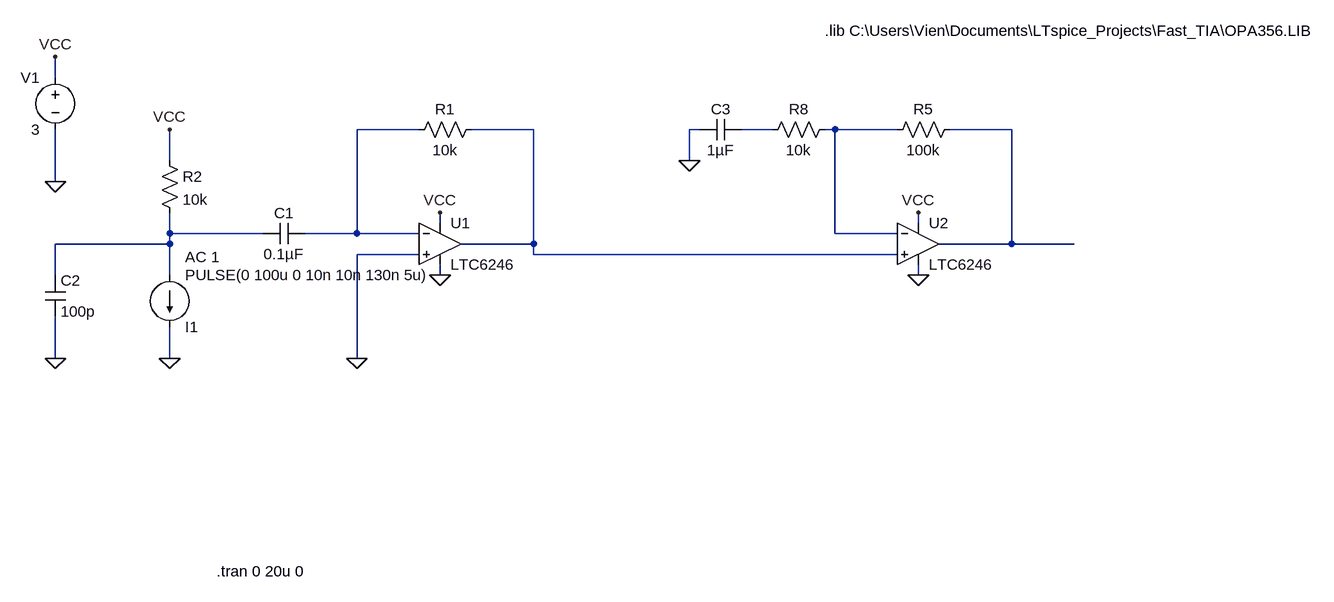
[diagram p0: schematic TIA.asc]
TIA.asc, the LTspice schematic file:
Version 4
SHEET 1 1508 688
WIRE -512 -96 -512 -128
WIRE 48 -16 -48 -16
WIRE 224 -16 128 -16
WIRE 480 -16 464 -16
WIRE 592 -16 544 -16
WIRE 688 -16 672 -16
WIRE 784 -16 688 -16
WIRE 960 -16 864 -16
WIRE -336 32 -336 -16
WIRE 464 32 464 -16
WIRE -512 64 -512 -16
WIRE 80 128 80 112
WIRE 816 128 816 112
WIRE -336 144 -336 112
WIRE -192 144 -336 144
WIRE -48 144 -48 -16
WIRE -48 144 -128 144
WIRE 48 144 -48 144
WIRE 688 144 688 -16
WIRE 784 144 688 144
WIRE -336 160 -336 144
WIRE -336 160 -512 160
WIRE 224 160 224 -16
WIRE 224 160 112 160
WIRE 960 160 960 -16
WIRE 960 160 848 160
WIRE 1056 160 960 160
WIRE 48 176 -48 176
WIRE 224 176 224 160
WIRE 784 176 224 176
WIRE -512 208 -512 160
WIRE -336 208 -336 160
WIRE 80 208 80 192
WIRE 816 208 816 192
WIRE -512 336 -512 272
WIRE -336 336 -336 288
WIRE -48 336 -48 176
FLAG 80 208 0
FLAG 80 112 VCC
FLAG -336 336 0
FLAG -512 336 0
FLAG -336 -16 VCC
FLAG -512 -128 VCC
FLAG -512 64 0
FLAG 816 208 0
FLAG 816 112 VCC
FLAG -48 336 0
FLAG 464 32 0
SYMBOL cap -128 128 R90
WINDOW 0 0 32 VBottom 2
WINDOW 3 32 32 VTop 2
SYMATTR InstName C1
SYMATTR Value 0.1µF
SYMBOL current -336 208 R0
WINDOW 0 24 80 Left 2
WINDOW 3 24 0 Left 2
WINDOW 123 24 -28 Left 2
WINDOW 39 0 0 Left 0
SYMATTR InstName I1
SYMATTR Value PULSE(0 100u 0 10n 10n 130n 5u)
SYMATTR Value2 AC 1
SYMBOL res -352 16 R0
SYMATTR InstName R2
SYMATTR Value 10k
SYMBOL cap -528 208 R0
SYMATTR InstName C2
SYMATTR Value 100p
SYMBOL voltage -512 -112 M0
WINDOW 123 0 0 Left 0
WINDOW 39 0 0 Left 0
SYMATTR InstName V1
SYMATTR Value 3
SYMBOL res 880 -32 R90
WINDOW 0 0 56 VBottom 2
WINDOW 3 32 56 VTop 2
SYMATTR InstName R5
SYMATTR Value 100k
SYMBOL res 688 -32 R90
WINDOW 0 0 56 VBottom 2
WINDOW 3 32 56 VTop 2
SYMATTR InstName R8
SYMATTR Value 10k
SYMBOL cap 544 -32 R90
WINDOW 0 0 32 VBottom 2
WINDOW 3 32 32 VTop 2
SYMATTR InstName C3
SYMATTR Value 1µF
SYMBOL res 144 -32 R90
WINDOW 0 0 56 VBottom 2
WINDOW 3 32 56 VTop 2
SYMATTR InstName R1
SYMATTR Value 10k
SYMBOL Opamps\\LTC6246 816 160 R0
SYMATTR InstName U2
SYMBOL Opamps\\LTC6246 80 160 R0
SYMATTR InstName U1
TEXT -264 664 Left 2 !.tran 0 20u 0
TEXT 672 -168 Left 2 !.lib C:\\Users\\Vien\\Documents\\LTspice_Projects\\Fast_TIA\\OPA356.LIB

The netlist it stands for:
* TIA.asc
C1 N001 N006 0.1µF
I1 N006 0 PULSE(0 100u 0 10n 10n 130n 5u) AC 1
R2 VCC N006 10k
C2 N006 0 100p
V1 VCC 0 3
R5 N005 N004 100k
R8 N004 N003 10k
C3 N003 0 1µF
R1 N002 N001 10k
* U2: LTC6246 (symbol Opamps\LTC6246 not available, pins judged from their places): In+=N002 In-=N004 V+=VCC V-=0 OUT=N005
* U1: LTC6246 (symbol Opamps\LTC6246 not available, pins judged from their places): In+=0 In-=N001 V+=VCC V-=0 OUT=N002
.tran 0 20u 0
.lib C:\Users\Vien\Documents\LTspice_Projects\Fast_TIA\OPA356.LIB
.backanno
.end